# EAGLE design fireflies (EAGLE 7.3.0)
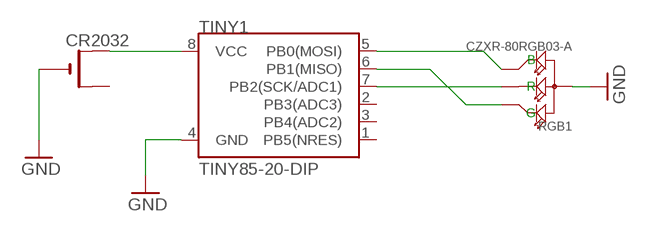
[diagram p0: schematic, sheet 1]

## Parts
CR2032  CR2032SMT  [CR2032-SMD]
RGB1  CZXR-80RGB03-A  DIP-LED-RGB-COMMON-ANODE(4P-D8MM)  [LED4-2.0-D8.0MM]
TINY1  TINY85-20-DIP  ATTINY45TINY85-20-DIP  [DIP08]

## Nets
GND: CR2032.- RGB1.2(+) TINY1.4(GND)
N$1: RGB1.4(B) TINY1.5(PB0(MOSI))
N$2: RGB1.1(R) TINY1.7(PB2(SCK/ADC1))
N$3: RGB1.3(G) TINY1.6(PB1(MISO))
N$4: CR2032.+$1(+) TINY1.8(VCC)
Unconnected: CR2032.+$2(+1) TINY1.1(PB5(NRES)) TINY1.2(PB3(ADC3)) TINY1.3(PB4(ADC2))

## Library data of the parts
CR2032 = adafruit:CR2032
RGB1 = Seeed-OPL-Diode:DIP-LED-RGB-COMMON-ANODE(4P-D8MM): 304090065; MPN: CZXR-80RGB03-A
TINY1 = SparkFun-DigitalIC:ATTINY45: Atmel 8-pin 2/4/8kB flash uC; PROD_ID: IC-09445

## Board
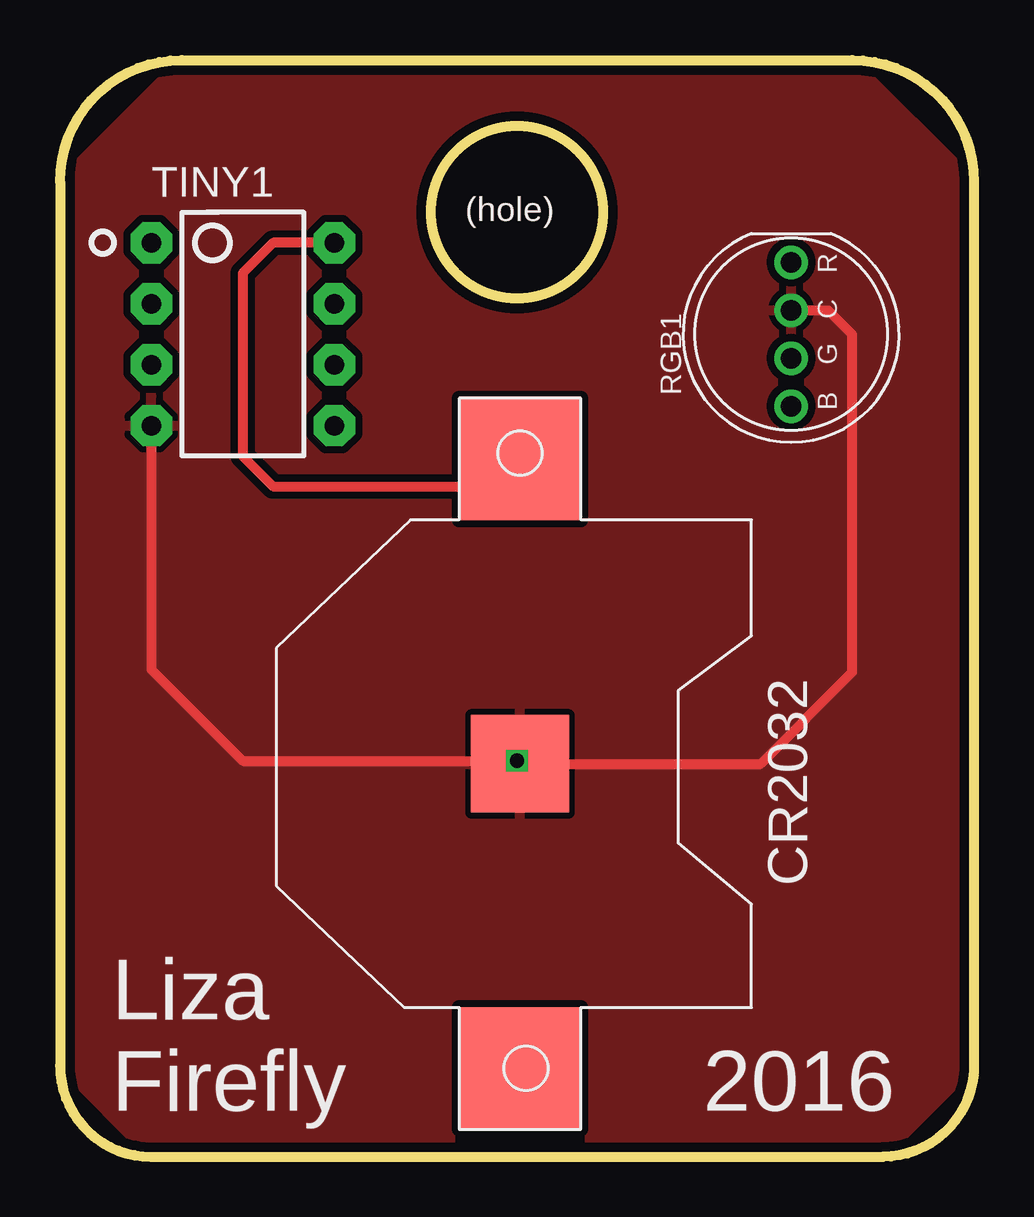
[diagram p1: board, top side]
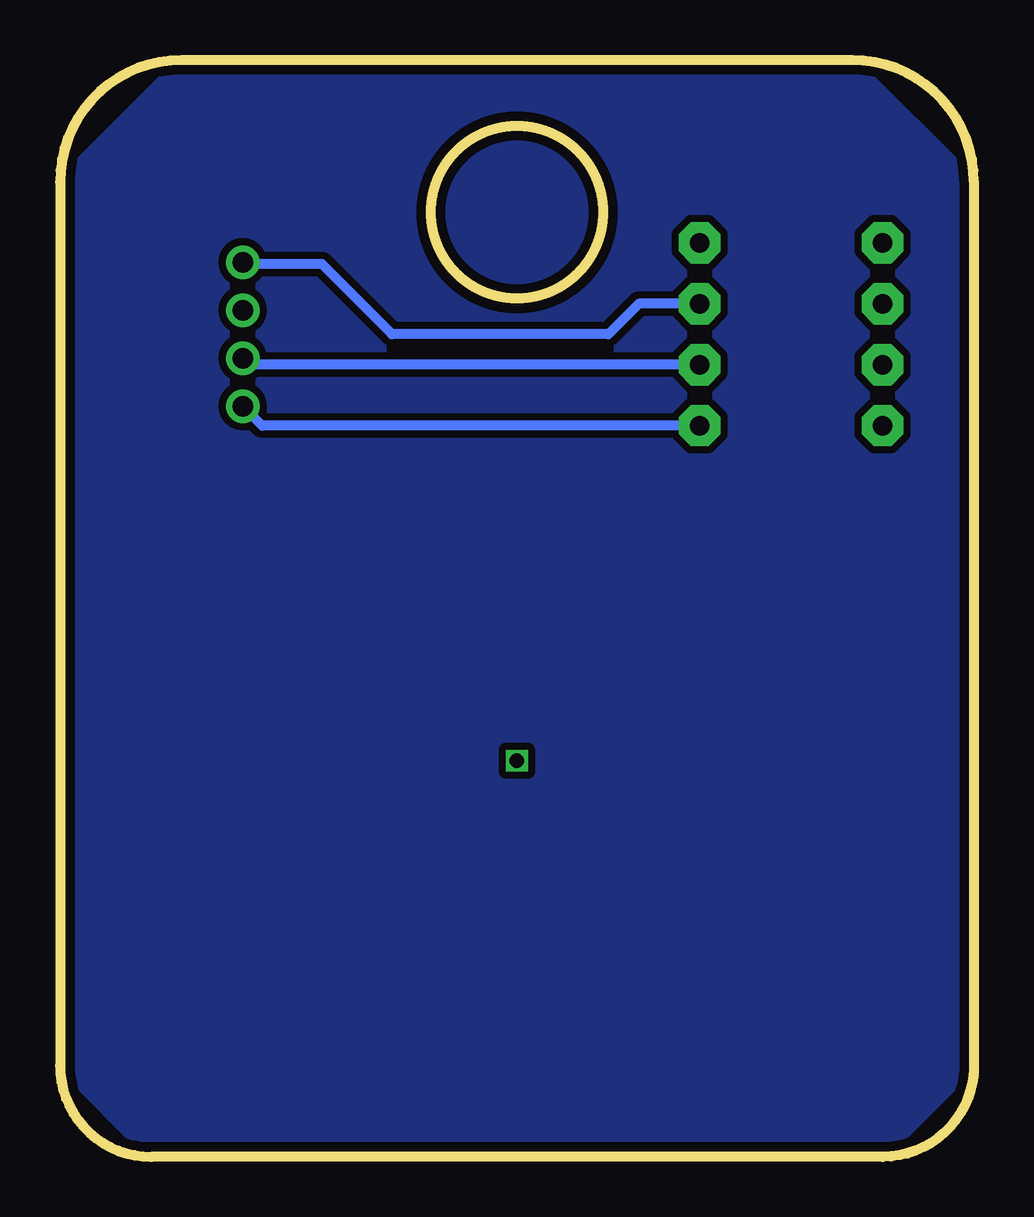
[diagram p2: board, bottom side, seen from below]

Size 38.1 x 45.72 mm. Coordinates in mm from the lower left corner, seen from the top.
Outline: 0,40.64 0,3.81 arc90 3.81,0 34.29,0 arc90 38.1,3.81 38.1,40.64 arc90 33.02,45.72 5.08,45.72 arc90 0,40.64
Outline: circle at 19.05,39.37 radius 3.59
Copper layers (1*16): Top 0.035mm / dielectric 1.5mm / Bottom 0.035mm
Design rules "NOA Eagle Rule 2016-06-12": minimum track width 6mil, minimum drill 0.3mm, track to track 6mil, track to pad 6mil, pad to pad 6mil, via to via 6mil, smd to smd 0mil, copper to edge 0.4mm, drill to drill 10mil, minimum pad ring 10mil, minimum via ring 6mil, stop-mask expansion 2mil, vias tented up to drill 25mil, thermal gap 10mil

### Footprints (pad centres in the part's own frame; a part is rotated, then mirrored left to right if it is on the bottom)
CR2032-SMD = smd 5.08 x 5.08: +$1 -12.7,0; +$2 12.7,0 | smd 4.064 x 4.064: - 0,0
LED4-2.0-D8.0MM = drill 0.85 pad 1.4: 1 3,0; 2 1,0; 3 -1,0; 4 -3,0
DIP08 = drill 0.813 pad 1.727 octagon: 1 -3.81,-3.81; 2 -1.27,-3.81; 3 1.27,-3.81; 4 3.81,-3.81; 5 3.81,3.81; 6 1.27,3.81; 7 -1.27,3.81; 8 -3.81,3.81

### Placement (x,y rotation side)
CR2032  19.18,16.38 270 top
RGB1  30.48,34.29 90 top
TINY1  7.62,34.29 270 top

### Tracks (layer width: path | path; a pad name or v marks a point on that pad's centre or on a via)
GND  (via drill 0.6)
  Top 0.406: TINY1.4 3.81,20.32 7.62,16.51 v19.05,16.51 CR2032.- 29.21,16.38 33.02,20.19 33.02,34.29 32.02,35.29 RGB1.2
  pour Top (isolate 0.305): 5.08,45.72 0,40.64 0,3.81 3.81,0 34.29,0 38.1,3.81 38.1,40.64 33.02,45.72
N$1
  Bottom 0.406: TINY1.5 29.67,30.48 RGB1.4
N$2
  Bottom 0.406: TINY1.7 13.97,35.56 15.24,34.29 24.26,34.29 27.18,37.21 30.4,37.21 RGB1.1
N$3
  Bottom 0.406: TINY1.6 30.21,33.02 RGB1.3
N$4
  Top 0.406: TINY1.8 8.89,38.1 7.62,36.83 7.62,29.21 8.89,27.94 18.03,27.94 CR2032.+$1
N$5
  pour Bottom (isolate 0.305): 5.08,45.72 33.02,45.72 38.1,40.64 38.1,5.08 38.1,3.81 34.29,0 5.08,0 3.81,0 0,3.81 0,40.64

### Text on the board
tPlace: (hole) | Liza / Firefly | 2016